# EAGLE design HMC6352v1.1 (EAGLE 5.06)
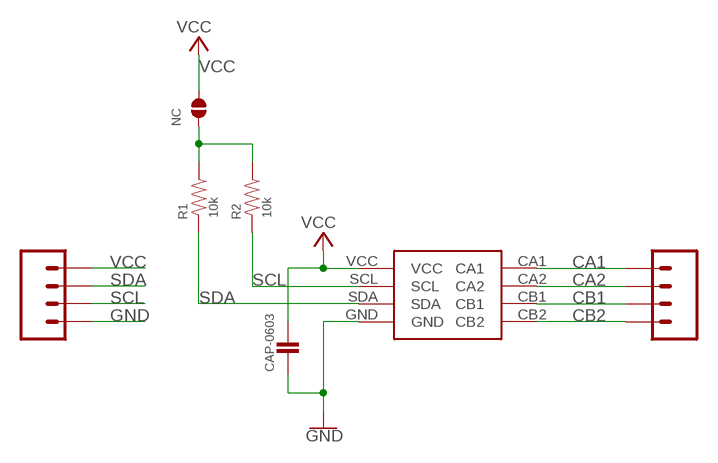
[diagram p0: schematic, sheet 1]

## Parts
NC1  NC  SOLDERJUMPER-NC  [SOLDE-JUMPER-NC]
R1  10k  RES-0603  [0603-RES]
R2  10k  RES-0603  [0603-RES]
U$1  HMC6352  [HMC6352]
U$4  M04  [M04]
U$5  M04  [M04]
U$6  CAP-0603  [0603-CAP]

## Nets
CA1: U$1.CA1 U$4.1
CA2: U$1.CA2 U$4.2
CB1: U$1.CB1 U$4.3
CB2: U$1.CB2 U$4.4
GND: U$1.GND U$5.1 U$6.2
N$1: NC1.1 R1.1 R2.1
SCL: R2.2 U$1.SCL U$5.2
SDA: R1.2 U$1.SDA U$5.3
VCC: NC1.2 U$1.VCC U$5.4 U$6.1

## Library data of the parts
NC1 = Travis:SOLDERJUMPER-NC
R1 R2 = Travis:RES-0603
U$1 = Travis:HMC6352
U$4 U$5 = Travis:M04
U$6 = Travis:CAP-0603

## Board
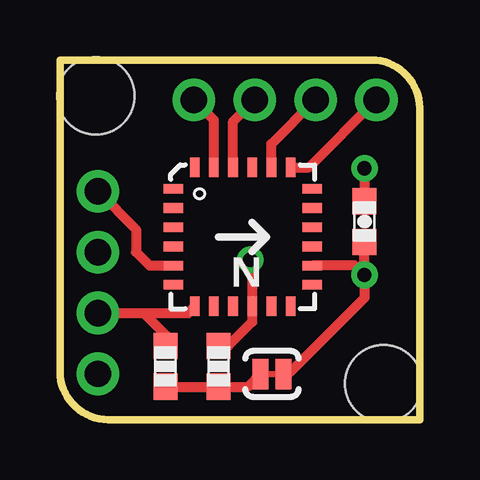
[diagram p1: board, top side]
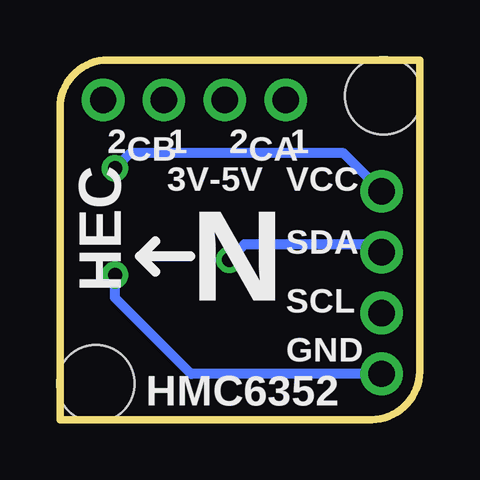
[diagram p2: board, bottom side, seen from below]

Size 15 x 15 mm. Coordinates in mm from the lower left corner, seen from the top.
Outline: 15,0 15,13 arc90 13,15 0,15 0,2 arc90 2,0 15,0
Copper layers (1*16): Top 0.035mm / dielectric 1.5mm / Bottom 0.035mm
Design rules "SparkFun": minimum track width 8mil, minimum drill 20mil, track to track 8mil, track to pad 8mil, pad to pad 8mil, via to via 8mil, smd to smd 8mil, copper to edge 10mil, drill to drill 8mil, minimum pad ring 12mil, minimum via ring 10mil, stop-mask expansion 4mil, vias tented up to drill 25mil, thermal gap 10mil
Holes 3.2 mm at 1.5,13.5 13.5,1.5

### Footprints (pad centres in the part's own frame; a part is rotated, then mirrored left to right if it is on the bottom)
SOLDE-JUMPER-NC = smd 0.66 x 1.27: 1 -0.476,0; 2 0.476,0
0603-RES = smd 1.1 x 1: 1 -0.85,0; 2 0.85,0
HMC6352 = smd 0.813 x 0.406: 1 -2.9,2; 2 -2.9,1.2; 3 -2.9,0.4; 4 -2.9,-0.4; 6 -2.9,-2; 13 2.9,-2; 15 2.9,-0.4; 16 2.9,0.4; 17 2.9,1.2; 18 2.9,2; GND -2.9,-1.2; VCC 2.9,-1.2 | smd 0.406 x 0.813: 8 -1.2,-2.9; 9 -0.4,-2.9; 11 1.2,-2.9; 12 2,-2.9; 21 0.4,2.9; 24 -2,2.9; CA1 -1.2,2.9; CA2 -0.4,2.9; CB1 1.2,2.9; CB2 2,2.9; SCL 0.4,-2.9; SDA -2,-2.9
M04 = drill 1.1 pad 1.778 round: 1 0,0; 2 0,-2.54; 3 0,-5.08; 4 0,-7.62
0603-CAP = smd 1.1 x 1: 1 -0.85,0; 2 0.85,0

### Placement (x,y rotation side)
NC1  8.84,1.91 0 top
R1  4.4,2.22 90 top
R2  6.62,2.22 90 top
U$1  7.62,7.62 0 top
U$4  5.58,13.34 90 top
U$5  1.59,9.53 0 top
U$6  12.7,8.26 90 top

### Tracks (layer width: path | path; a pad name or v marks a point on that pad's centre or on a via)
CA1
  Top 0.406: U$4.1 6.42,12.49 U$1.CA1
CA2
  Top 0.406: U$4.2 7.22,12.44 U$1.CA2
CB1
  Top 0.406: U$4.3 8.82,11.49 U$1.CB1
CB2
  Top 0.406: U$4.4 10.38,10.52 U$1.CB2
GND  (via drill 0.6)
  Top 0.406: U$5.1 3.17,7.94 3.17,6.99 3.74,6.42 U$1.GND | v12.7,10.48 U$6.2
  Bottom 0.406: U$5.1 3.17,11.11 12.06,11.11 v12.7,10.48
N$1
  Top 0.406: R1.1 R2.1 7.83,1.37 NC1.1
SCL  (via drill 0.6)
  Top 0.406: R2.2 7.02,3.07 8.02,4.07 U$1.SCL 8.02,6.58 v7.94,6.67
  Bottom 0.406: U$5.2 1.91,7.3 7.3,7.3 v7.94,6.67
SDA
  Top 0.406: U$1.SDA 5.34,4.45 3.49,4.45 | U$5.3 3.49,4.45 | R1.2 4.4,3.54 3.49,4.45
VCC  (via drill 0.6)
  Top 0.406: NC1.2 9.53,1.91 12.7,5.08 v12.7,6.03 | 12.66,7.41 U$6.1 v12.7,6.03 | U$1.VCC 12.31,6.42 v12.7,6.03
  Bottom 0.406: U$5.4 9.53,1.91 12.7,5.08 v12.7,6.03

### Text on the board
bPlace: N | HEC
bNames: 1 | CA | 2 | 1 | CB | 2 | VCC | 3V-5V | SDA | SCL | GND | HMC6352